# EAGLE schematic untitled (EAGLE 6.5.0)
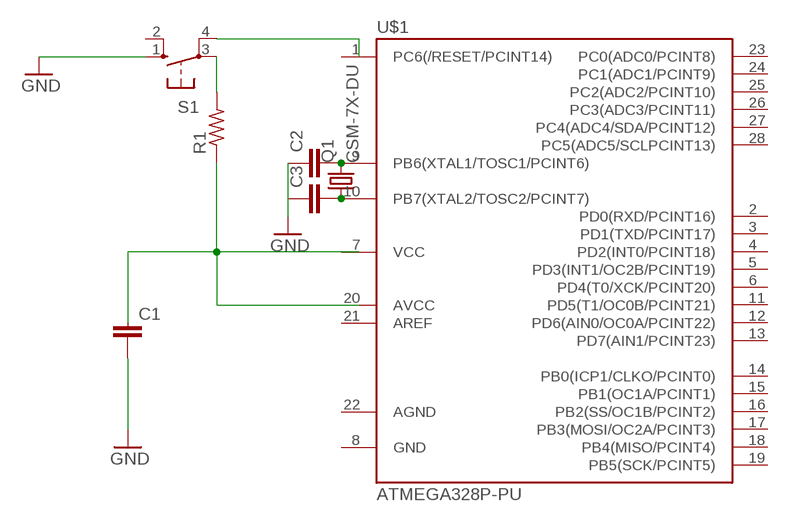
[diagram p0: schematic, sheet 1]

## Parts
C1  C-EU025-024X044  [C025-024X044]
C2  C-EU025-025X050  [C025-025X050]
C3  C-EU025-025X050  [C025-025X050]
Q1  CSM-7X-DU  [CSM-7X-DU]
R1  R-US_0309/10  [0309/10]
S1  10-XX  [B3F-10XX]
U$1  ATMEGA328P-PU  [DIL28/3]

## Nets
GND: C1.2 C2.1 C3.1 S1.1(S)
N$1: R1.1
N$2: R1.2
N$3: S1.4(P1)
N$4: C2.2 Q1.2 U$1.9(PB6(XTAL1/TOSC1/PCINT6))
N$5: C3.2 Q1.1 U$1.10(PB7(XTAL2/TOSC2/PCINT7))
Unconnected: C1.1 S1.2(S1) S1.3(P) U$1.1(PC6(/RESET/PCINT14)) U$1.2(PD0(RXD/PCINT16)) U$1.3(PD1(TXD/PCINT17)) U$1.4(PD2(INT0/PCINT18)) U$1.5(PD3(INT1/OC2B/PCINT19)) U$1.6(PD4(T0/XCK/PCINT20)) U$1.11(PD5(T1/OC0B/PCINT21)) U$1.12(PD6(AIN0/OC0A/PCINT22)) U$1.13(PD7(AIN1/PCINT23)) U$1.14(PB0(ICP1/CLKO/PCINT0)) U$1.15(PB1(OC1A/PCINT1)) U$1.16(PB2(SS/OC1B/PCINT2)) U$1.17(PB3(MOSI/OC2A/PCINT3)) U$1.18(PB4(MISO/PCINT4)) U$1.19(PB5(SCK/PCINT5)) U$1.20(AVCC) U$1.21(AREF) U$1.23(PC0(ADC0/PCINT8)) U$1.24(PC1(ADC1/PCINT9)) U$1.25(PC2(ADC2/PCINT10)) U$1.26(PC3(ADC3/PCINT11)) U$1.27(PC4(ADC4/SDA/PCINT12)) U$1.28(PC5(ADC5/SCLPCINT13))

## Power pins joined to a net without a drawn wire
AGND: U$1.22(AGND)
GND: U$1.8(GND)
VCC: U$1.7(VCC)

## Library data of the parts
C1 = resistor:C-EU: CAPACITOR, European symbol
C2 C3 = rcl:C-EU: CAPACITOR, European symbol
Q1 = crystal:CSM-7X-DU: SMD CRYSTAL Source: www.ecsxtal.com .. Crystal 3.6864MHz CSM_7X_DU.PDF; OC_FARNELL: unknown; OC_NEWARK: unknown
R1 = rcl:R-US_: RESISTOR, American symbol
S1 = switch-omron:10-XX: OMRON SWITCH; MPN: B3F-1000; OC_FARNELL: 176432; OC_NEWARK: 36M3542
U$1 = avr-7:ATMEGA328P-PU